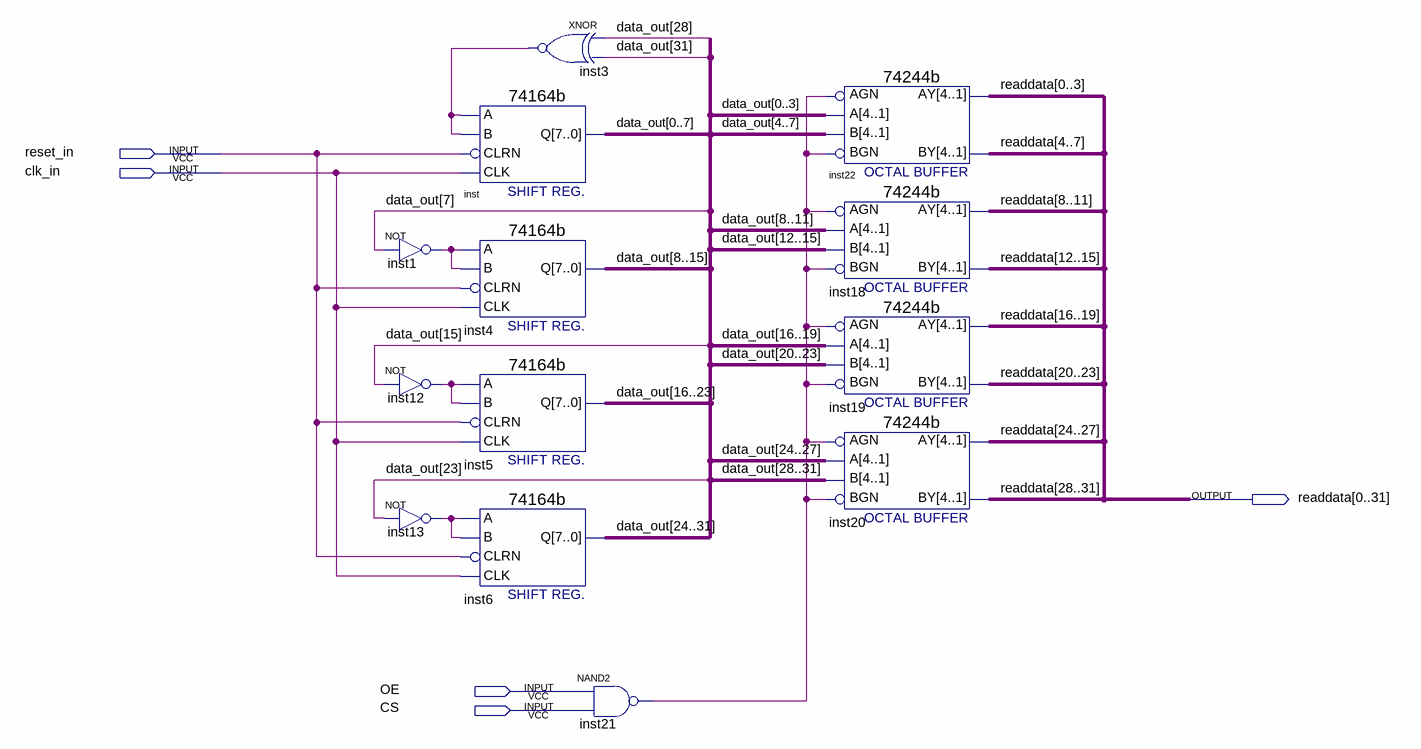
[diagram p0: schematic sheet]
// Quartus schematic LFSR.bdf as structural Verilog: 13 symbols, 5 pins
module LFSR (
  input  reset_in,
  input  clk_in,
  input  OE,
  input  CS,
  output [0:31] readdata
);

  wire inst1_out, inst3_out, inst12_out, inst13_out, inst21_out;
  wire [31:0] data_out;

  not inst1 (inst1_out, data_out[7]);
  not inst12 (inst12_out, data_out[15]);
  not inst13 (inst13_out, data_out[23]);
  \74164b  inst (
    .A(inst3_out), .B(inst3_out), .CLRN(reset_in), .CLK(clk_in),
    .Q({data_out[0], data_out[1], data_out[2], data_out[3], data_out[4], data_out[5], data_out[6], data_out[7]}));
  \74164b  inst4 (
    .A(inst1_out), .B(inst1_out), .CLRN(reset_in), .CLK(clk_in),
    .Q({data_out[8], data_out[9], data_out[10], data_out[11], data_out[12], data_out[13], data_out[14], data_out[15]}));
  \74164b  inst5 (
    .A(inst12_out), .B(inst12_out), .CLRN(reset_in), .CLK(clk_in),
    .Q({data_out[16], data_out[17], data_out[18], data_out[19], data_out[20], data_out[21], data_out[22], data_out[23]}));
  \74164b  inst6 (
    .A(inst13_out), .B(inst13_out), .CLRN(reset_in), .CLK(clk_in),
    .Q({data_out[24], data_out[25], data_out[26], data_out[27], data_out[28], data_out[29], data_out[30], data_out[31]}));
  xnor inst3 (inst3_out, data_out[28], data_out[31]);
  nand inst21 (inst21_out, OE, CS);
  \74244b  inst22 (
    .AGN(inst21_out), .B({data_out[4], data_out[5], data_out[6], data_out[7]}), .BGN(inst21_out),
    .A({data_out[0], data_out[1], data_out[2], data_out[3]}), .AY(readdata[0:3]), .BY(readdata[4:7]));
  \74244b  inst18 (
    .AGN(inst21_out), .B({data_out[12], data_out[13], data_out[14], data_out[15]}), .BGN(inst21_out),
    .A({data_out[8], data_out[9], data_out[10], data_out[11]}), .AY(readdata[8:11]), .BY(readdata[12:15]));
  \74244b  inst19 (
    .AGN(inst21_out), .B({data_out[20], data_out[21], data_out[22], data_out[23]}), .BGN(inst21_out),
    .A({data_out[16], data_out[17], data_out[18], data_out[19]}), .AY(readdata[16:19]), .BY(readdata[20:23]));
  \74244b  inst20 (
    .AGN(inst21_out), .B({data_out[28], data_out[29], data_out[30], data_out[31]}), .BGN(inst21_out),
    .A({data_out[24], data_out[25], data_out[26], data_out[27]}), .AY(readdata[24:27]), .BY(readdata[28:31]));
endmodule
